# EAGLE design displayBoard (EAGLE 7.4.0)
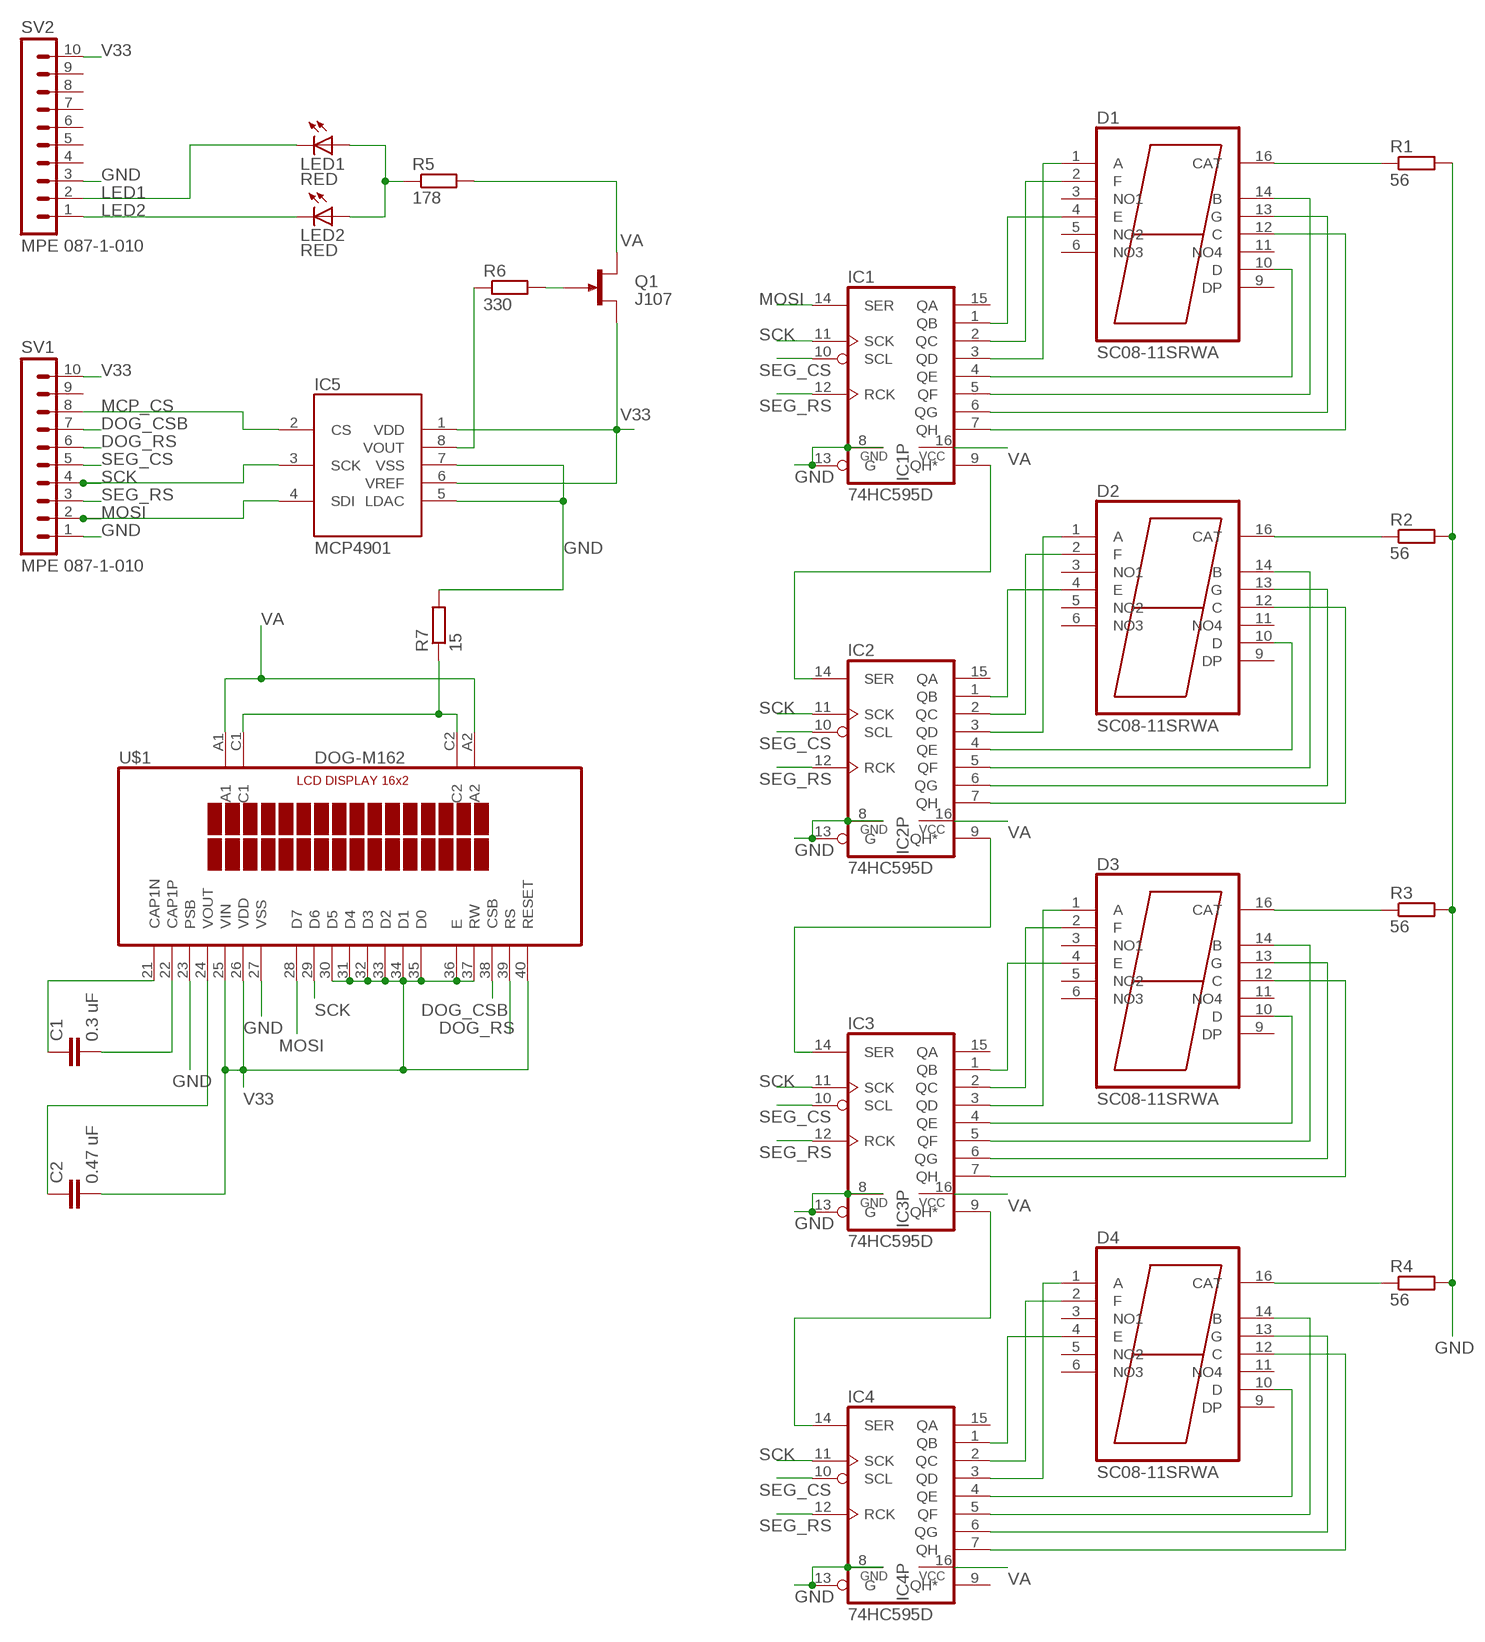
[diagram p0: schematic, sheet 1]

## Parts
C1  0.3 uF  C-EUC1206  [C1206]
C2  0.47 uF  C-EUC1206  [C1206]
D1  SC08-11SRWA  [SC08-11SRWA]
D2  SC08-11SRWA  [SC08-11SRWA]
D3  SC08-11SRWA  [SC08-11SRWA]
D4  SC08-11SRWA  [SC08-11SRWA]
IC1  74HC595D  [SO16]
IC2  74HC595D  [SO16]
IC3  74HC595D  [SO16]
IC4  74HC595D  [SO16]
IC5  MCP4901  [MSOP8]
LED1  RED  LED3MM  [LED3MM]
LED2  RED  LED3MM  [LED3MM]
Q1  J107  J105  [TO92R]
R1  56  R-EU_R1206  [R1206]
R2  56  R-EU_R1206  [R1206]
R3  56  R-EU_R1206  [R1206]
R4  56  R-EU_R1206  [R1206]
R5  178  R-EU_R1206  [R1206]
R6  330  R-EU_R1206  [R1206]
R7  15  R-EU_R1206  [R1206]
SV1  MPE 087-1-010  MA10-1  [MA10-1]
SV2  MPE 087-1-010  MA10-1  [MA10-1]
U$1  DOG-M162  [DOGM162]

## Nets
DOG_CSB: SV1.7 U$1.38(CSB)
DOG_RS: SV1.6 U$1.39(RS)
GND: IC1.8(GND) IC1.13(G) IC2.8(GND) IC2.13(G) IC3.8(GND) IC3.13(G) IC4.8(GND) IC4.13(G) IC5.5(LDAC) IC5.7(VSS) R1.2 R2.2 R3.2 R4.2 R7.2 SV1.1 SV2.3 U$1.23(PSB) U$1.27(VSS)
LED1: LED1.K(C) SV2.2
LED2: LED2.K(C) SV2.1
MCP_CS: IC5.2(CS) SV1.8
MOSI: IC1.14(SER) IC5.4(SDI) SV1.2 U$1.28(D7)
N$1: D1.4(E) IC1.1(QB)
N$2: D1.2(F) IC1.2(QC)
N$3: D1.1(A) IC1.3(QD)
N$4: D1.10(D) IC1.4(QE)
N$5: D1.14(B) IC1.5(QF)
N$6: D1.13(G) IC1.6(QG)
N$7: D1.12(C) IC1.7(QH)
N$8: D2.4(E) IC2.1(QB)
N$9: D2.2(F) IC2.2(QC)
N$10: D2.1(A) IC2.3(QD)
N$11: D2.10(D) IC2.4(QE)
N$12: D2.14(B) IC2.5(QF)
N$13: D2.13(G) IC2.6(QG)
N$14: D2.12(C) IC2.7(QH)
N$17: IC1.9(QH*) IC2.14(SER)
N$22: D3.4(E) IC3.1(QB)
N$23: D3.2(F) IC3.2(QC)
N$24: D3.1(A) IC3.3(QD)
N$25: D3.10(D) IC3.4(QE)
N$26: D3.14(B) IC3.5(QF)
N$27: D3.13(G) IC3.6(QG)
N$28: D3.12(C) IC3.7(QH)
N$29: D4.4(E) IC4.1(QB)
N$30: D4.2(F) IC4.2(QC)
N$31: D4.1(A) IC4.3(QD)
N$32: D4.10(D) IC4.4(QE)
N$33: D4.14(B) IC4.5(QF)
N$34: D4.13(G) IC4.6(QG)
N$35: D4.12(C) IC4.7(QH)
N$36: IC3.9(QH*) IC4.14(SER)
N$37: IC2.9(QH*) IC3.14(SER)
N$38: D1.16(CAT) R1.1
N$39: D2.16(CAT) R2.1
N$40: D3.16(CAT) R3.1
N$41: D4.16(CAT) R4.1
N$42: LED1.A LED2.A R5.1
N$46: C1.1 U$1.21(CAP1N)
N$47: C1.2 U$1.22(CAP1P)
N$48: C2.1 U$1.24(VOUT)
N$52: IC5.8(VOUT) R6.1
N$53: Q1.G R6.2
N$60: R7.1 U$1.C1 U$1.C2
SCK: IC1.11(SCK) IC2.11(SCK) IC3.11(SCK) IC4.11(SCK) IC5.3(SCK) SV1.4 U$1.29(D6)
SEG_CS: IC1.10(SCL) IC2.10(SCL) IC3.10(SCL) IC4.10(SCL) SV1.5
SEG_RS: IC1.12(RCK) IC2.12(RCK) IC3.12(RCK) IC4.12(RCK) SV1.3
V33: C2.2 IC5.1(VDD) IC5.6(VREF) Q1.S SV1.10 SV2.10 U$1.25(VIN) U$1.26(VDD) U$1.30(D5) U$1.31(D4) U$1.32(D3) U$1.33(D2) U$1.34(D1) U$1.35(D0) U$1.36(E) U$1.37(RW) U$1.40(RESET)
VA: IC1.16(VCC) IC2.16(VCC) IC3.16(VCC) IC4.16(VCC) Q1.D R5.2 U$1.A1 U$1.A2
Unconnected: D1.3(NO1) D1.5(NO2) D1.6(NO3) D1.9(DP) D1.11(NO4) D2.3(NO1) D2.5(NO2) D2.6(NO3) D2.9(DP) D2.11(NO4) D3.3(NO1) D3.5(NO2) D3.6(NO3) D3.9(DP) D3.11(NO4) D4.3(NO1) D4.5(NO2) D4.6(NO3) D4.9(DP) D4.11(NO4) IC1.15(QA) IC2.15(QA) IC3.15(QA) IC4.9(QH*) IC4.15(QA) SV1.9 SV2.4 SV2.5 SV2.6 SV2.7 SV2.8 SV2.9

## Library data of the parts
C1 C2 = resistor:C-EU: CAPACITOR, European symbol
D1-D4 = MyComponents:SC08-11SRWA: 20.32mm (0.8INCH) SINGLE DIGIT NUMERIC DISPLAY
IC1-IC4 = 74xx-eu:74*595: 8-bit SHIFT REGISTER, output latch
IC5 = MyComponents:MCP4901: 8/10/12-Bit Voltage Output Digital-to-Analog Converter with SPI Interface
LED1 LED2 = led:LED: LED OSRAM: - CHIPLED LG R971, LG N971, LY N971, LG Q971, LY Q971, LO R971, LY R971 LH N974, LH R974 LS Q976, LO Q976, LY Q976 LO Q996 - Hyper CHIPLED LW Q18S LB Q993, LB Q99A, LB R99A - SideLED LS A670, LO A670, LY A670, LG A670, LP A670 LB A673, LV A673, LT A673, LW A673 LH A674 LY A675 LS A676, LA A676, LO A676, LY A676, LW A676 LS A679, LY A679, LG A679 - Hyper Micro SIDELED® LS Y876, LA Y876, LO Y876, LY Y876 LT Y87S - SmartLED LW L88C, LW L88S LB L89C, LB L89S, LG L890 LS L89K, LO L89K, LY L89K LS L896, LA L896, LO L896, LY L896 - TOPLED LS T670, LO T670, LY T670, LG T670, LP T670 LSG T670, LSP T670, LSY T670, LOP T670, LYG T670 LG T671, LOG T671, LSG T671 LB T673, LV T673, LT T673, LW T673 LH T674 LS T676, LA T676, LO T676, LY T676, LB T676, LH T676, LSB T676, LW T676 LB T67C, LV T67C, LT T67C, LS T67K, LO T67K, LY T67K, LW E67C LS E67B, LA E67B, LO E67B, LY E67B, LB E67C, LV E67C, LT E67C LW T67C LS T679, LY T679, LG T679 LS T770, LO T770, LY T770, LG T770, LP T770 LB T773, LV T773, LT T773, LW T773 LH T774 LS E675, LA E675, LY E675, LS T675 LS T776, LA T776, LO T776, LY T776, LB T776 LHGB T686 LT T68C, LB T68C - Hyper Mini TOPLED® LB M676 - Mini TOPLED Santana® LG M470 LS M47K, LO M47K, LY M47K Source: http://www.osram.convergy.de LUXEON: - LUMILED® LXK2-PW12-R00, LXK2-PW12-S00, LXK2-PW14-U00, LXK2-PW14-V00 LXK2-PM12-R00, LXK2-PM12-S00, LXK2-PM14-U00 LXK2-PE12-Q00, LXK2-PE12-R00, LXK2-PE12-S00, LXK2-PE14-T00, LXK2-PE14-U00 LXK2-PB12-K00, LXK2-PB12-L00, LXK2-PB12-M00, LXK2-PB14-N00, LXK2-PB14-P00, LXK2-PB14-Q00 LXK2-PR12-L00, LXK2-PR12-M00, LXK2-PR14-Q00, LXK2-PR14-R00 LXK2-PD12-Q00, LXK2-PD12-R00, LXK2-PD12-S00 LXK2-PH12-R00, LXK2-PH12-S00 LXK2-PL12-P00, LXK2-PL12-Q00, LXK2-PL12-R00 Source: www.luxeon.com KINGBRIGHT: KA-3528ASYC Source: www.kingbright.com
Q1 = transistor-small-signal:J105: N-CHANNEL FET J105, J106, J107 Source: http://www.fairchildsemi.com/pf/J1/J105.html
R1-R7 = resistor:R-EU_: RESISTOR, European symbol
SV1 SV2 = con-lstb:MA10-1: PIN HEADER; OC_FARNELL: unknown; OC_NEWARK: unknown
U$1 = MyComponents:DOG-M162: LCD display DOG-SERIE 3,3V. Controlleer ST7036 for 4-/8-BIT, SPI.

## Board
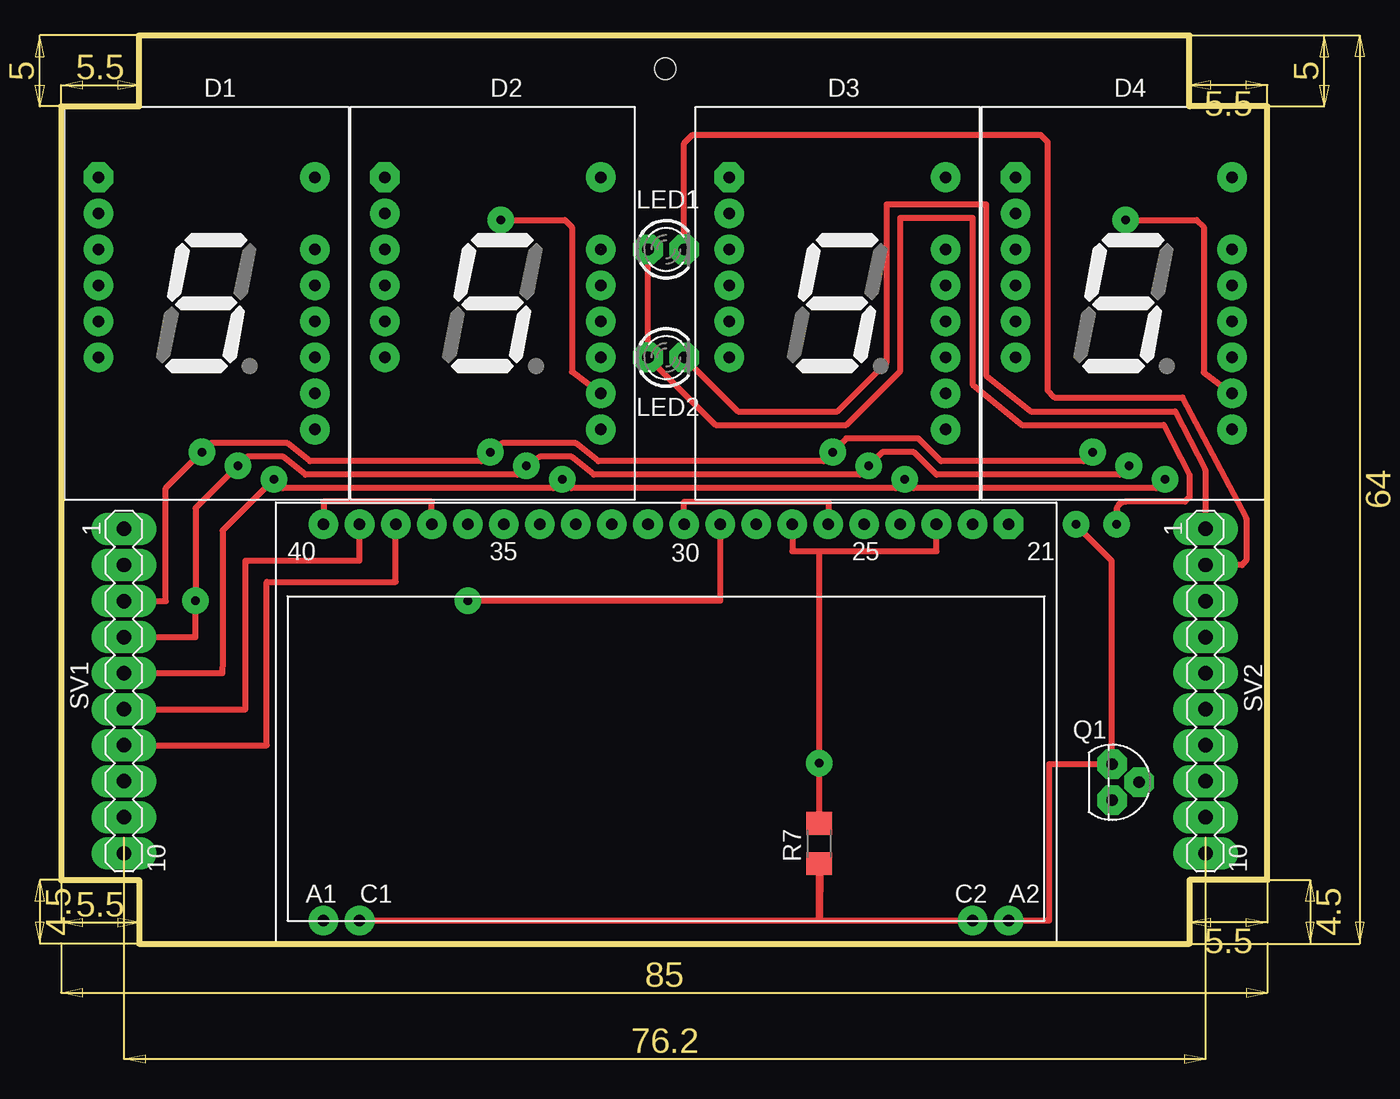
[diagram p1: board, top side]
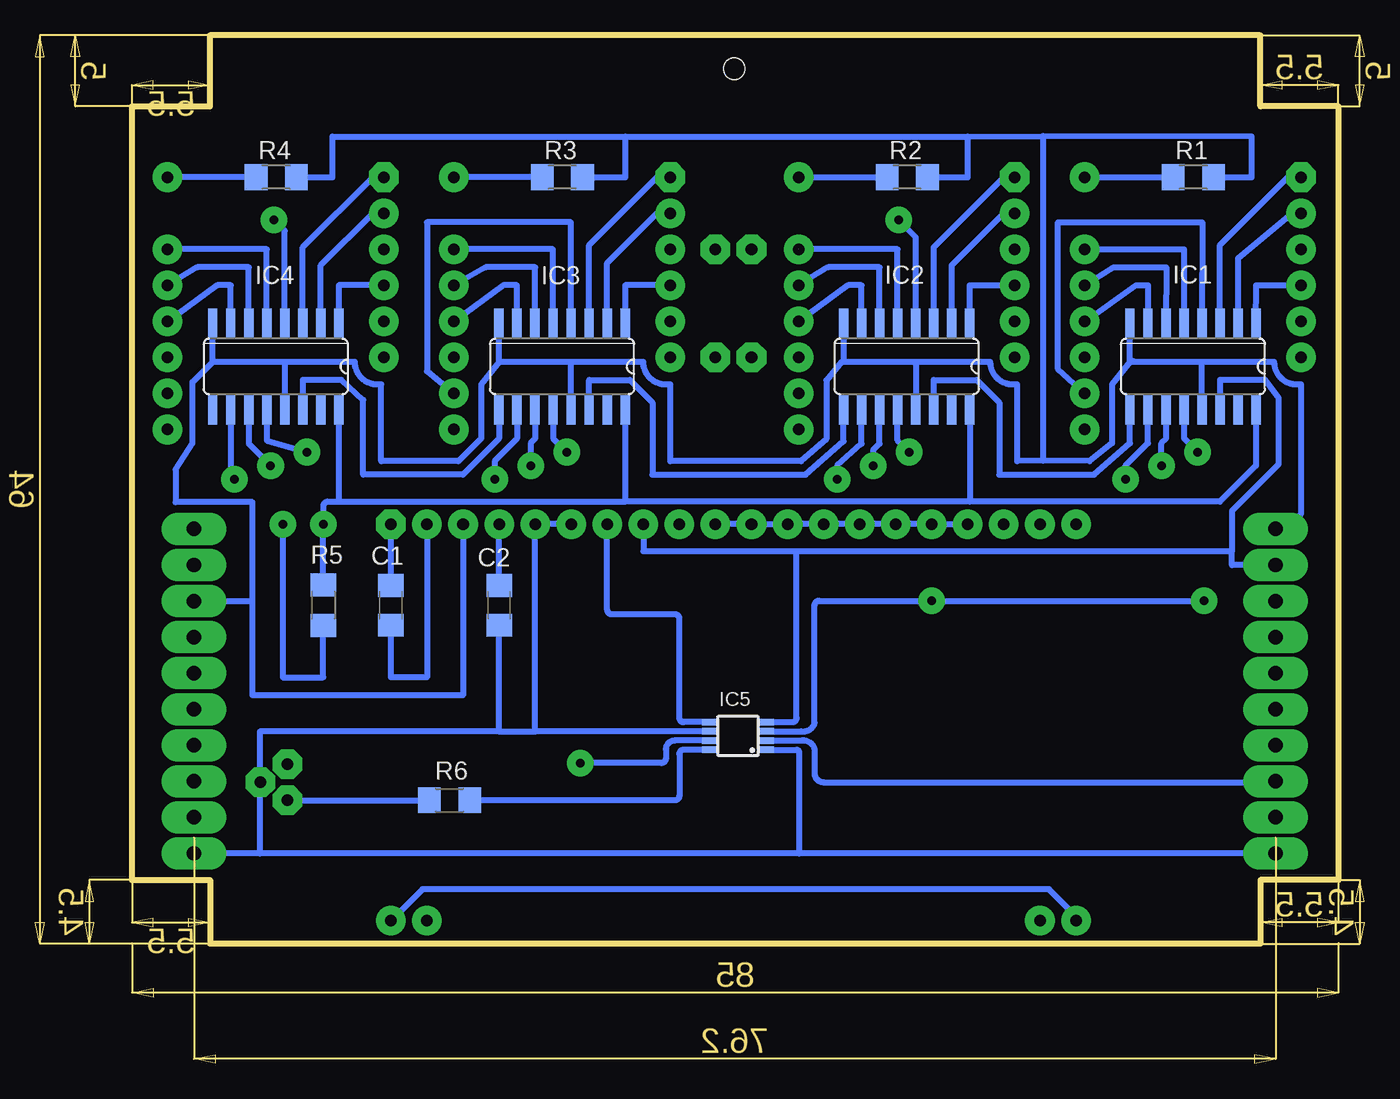
[diagram p2: board, bottom side, seen from below]

Size 85 x 64 mm. Coordinates in mm from the lower left corner, seen from the top.
Outline: 5.5,64 79.5,64 79.5,59 85,59 85,4.5 79.5,4.5 79.5,0 5.5,0 5.5,4.5 0,4.5 0,59 5.5,59 5.5,64
Copper layers (1*16): Top 0.035mm / dielectric 1.5mm / Bottom 0.035mm
Design rules "default": minimum track width 20mil, minimum drill 32mil, track to track 12mil, track to pad 12mil, pad to pad 12mil, via to via 12mil, smd to smd 8mil, copper to edge 40mil, drill to drill 40mil, minimum pad ring 25mil, minimum via ring 25mil, stop-mask expansion 4mil, vias tented up to drill 0mil, thermal gap 10mil
Holes 1.5 mm at 42.56,61.66

### Footprints (pad centres in the part's own frame; a part is rotated, then mirrored left to right if it is on the bottom)
C1206 = smd 1.6 x 1.8: 1 -1.4,0; 2 1.4,0
SC08-11SRWA = drill 0.813 octagon: 1 -7.62,8.89 | drill 0.813: 2 -7.62,6.35; 3 -7.62,3.81; 4 -7.62,1.27; 5 -7.62,-1.27; 6 -7.62,-3.81; 9 7.62,-8.89; 10 7.62,-6.35; 11 7.62,-3.81; 12 7.62,-1.27; 13 7.62,1.27; 14 7.62,3.81; 16 7.62,8.89
SO16 = smd 0.66 x 2.032: 1 -4.445,-3.073; 2 -3.175,-3.073; 3 -1.905,-3.073; 4 -0.635,-3.073; 5 0.635,-3.073; 6 1.905,-3.073; 7 3.175,-3.073; 8 4.445,-3.073; 9 4.445,3.073; 10 3.175,3.073; 11 1.905,3.073; 12 0.635,3.073; 13 -0.635,3.073; 14 -1.905,3.073; 15 -3.175,3.073; 16 -4.445,3.073
MSOP8 = smd 0.45 x 1: 1 -0.975,-2.05; 2 -0.325,-2.05; 3 0.325,-2.05; 4 0.975,-2.05; 5 0.975,2.05; 6 0.325,2.05; 7 -0.325,2.05; 8 -0.975,2.05
LED3MM = drill 0.813 octagon: A -1.27,0; K 1.27,0
TO92R = drill 0.813 octagon: D -1.27,0; G 1.27,0; S 0,1.905
R1206 = smd 1.6 x 1.803: 1 -1.422,0; 2 1.422,0
MA10-1 = drill 1.016 long: 1 -11.43,0; 2 -8.89,0; 3 -6.35,0; 4 -3.81,0; 5 -1.27,0; 6 1.27,0; 7 3.81,0; 8 6.35,0; 9 8.89,0; 10 11.43,0
DOGM162 = drill 0.813 octagon: 21 24.13,13.97 | drill 0.813: 22 21.59,13.97; 23 19.05,13.97; 24 16.51,13.97; 25 13.97,13.97; 26 11.43,13.97; 27 8.89,13.97; 28 6.35,13.97; 29 3.81,13.97; 30 1.27,13.97; 31 -1.27,13.97; 32 -3.81,13.97; 33 -6.35,13.97; 34 -8.89,13.97; 35 -11.43,13.97; 36 -13.97,13.97; 37 -16.51,13.97; 38 -19.05,13.97; 39 -21.59,13.97; 40 -24.13,13.97; A1 -24.13,-13.97; A2 24.13,-13.97; C1 -21.59,-13.97; C2 21.59,-13.97

### Placement (x,y rotation side)
C1  66.75,23.85 270 bottom
C2  59.14,23.85 270 bottom
D1  10.25,45.12 0 top
D2  30.42,45.12 0 top
D3  54.7,45.12 0 top
D4  74.87,45.12 0 top
IC1  10.25,40.68 180 bottom
IC2  30.42,40.68 180 bottom
IC3  54.7,40.68 180 bottom
IC4  74.87,40.68 180 bottom
IC5  42.31,14.64 90 bottom
LED1  42.62,48.94 0 top
LED2  42.62,41.31 0 top
Q1  74.06,11.38 270 top
R1  10.23,54.02 0 bottom
R2  30.38,54.02 0 bottom
R3  54.68,54.02 0 bottom
R4  74.83,54.02 0 bottom
R5  71.52,23.85 90 bottom
R6  62.63,10.11 180 bottom
R7  53.4,7.06 90 top
SV1  4.43,17.8 270 top
SV2  80.63,17.8 270 top
U$1  42.62,15.6 0 top

### Tracks (layer width: path | path; a pad name or v marks a point on that pad's centre or on a via)
DOG_CSB
  Top 0.406: SV1.7 14.5,13.99 14.5,25.5 23.57,25.5 U$1.38
DOG_RS
  Top 0.406: SV1.6 13,16.53 13,27 21.04,27 U$1.39
GND  (via drill 0.6)
  Top 0.406: U$1.27 51.52,27.66 53.42,27.66 | 53.42,27.66 61.67,27.66 U$1.23 | 53.42,27.66 v53.42,12.74 53.41,12.74 R7.2
  Bottom 0.406: 14.37,41 14.68,41 | 14.68,41 14.68,43.74 IC1.8 | IC2.8 34.87,41 | 14.68,41 15.95,39.41 15.95,35.28 17.54,34.01 20.81,34.04 | 20.81,34.04 22.62,34.01 22.62,39.41 22.94,39.41 arc90 24.53,41 29.61,41 | 29.61,41 34.87,41 | 29.92,37.61 IC2.13 29.78,40.82 arc90 29.61,41 | 34.87,41 35.01,41 36.08,39.69 36.08,35.56 37.86,34.01 47.07,34.01 47.07,39.41 47.39,39.41 arc90 48.98,41 54.05,41 | 54.05,41 59.14,41 | 59.14,41 59.14,43.74 arc-90 IC3.8 | 54.05,41 arc-90 54.07,40.98 IC3.13 54.07,37.29 | SV1.1 2.62,30.3 2.62,39.41 2.94,39.41 arc90 4.53,41 9.61,41 | 9.61,41 14.37,41 | 14.37,41 arc-90 14.68,41 | IC1.13 9.62,40.98 arc90 9.61,41 | 59.14,41 60.41,39.41 60.41,35.6 61.99,34.01 67.44,34.01 67.44,39.41 67.71,39.41 arc90 69.3,41 74.23,41 | 74.23,41 79.31,41 | 79.31,41 IC4.8 | 74.23,41 IC4.13 | R4.2 70.88,54.02 70.88,56.87 50.24,56.87 | 50.24,56.87 26.11,56.87 | 26.11,56.87 20.81,56.9 | R1.2 6.11,54.02 6.11,56.87 20.81,56.9 | R2.2 26.11,54.02 26.11,56.87 | R3.2 50.24,54.02 50.24,56.87 | 79.31,41 80.72,39.59 80.72,35.28 81.92,33.42 81.92,31.12 76.5,31.12 76.5,24.15 | IC5.5 46.14,15.62 arc90 46.44,15.91 46.44,22.9 arc-90 46.75,23.22 51.2,23.22 arc90 51.52,23.54 U$1.27 | IC5.7 46.76,14.32 arc-90 47.39,13.69 47.39,13.06 arc90 47.7,12.74 v53.42,12.74 | U$1.23 61.67,17.5 76.5,17.5 76.5,24.15 | 20.81,56.9 20.81,34.04 | SV2.3 76.5,24.15
LED1
  Top 0.406: LED1.K 43.9,56.4 44.5,57 69,57 69.5,56.5 69.5,39 70,38.5 79,38.5 83.5,30 83.5,27 83.19,26.69 SV2.2
LED2
  Top 0.406: LED2.K 47.7,37.51 54.69,37.51 58.18,41 58.18,52.11 65.17,52.11 65.17,40.05 68.34,37.51 78.5,37.51 80.61,33.41 80.61,28.76 SV2.1
MCP_CS
  Bottom 0.406: IC5.2 37.85,14.32 arc90 36.91,13.69 36.91,12.02 arc-90 36.27,11.38 4.57,11.38 arc-90 SV1.8
MOSI
  Bottom 0.406: IC1.14 8.35,39.73 5.16,39.73 4.21,38.46 4.21,33.79 7.5,30.5 7.5,27.66 | U$1.28 48.98,27.66 38.18,27.66 | IC5.4 38.48,15.62 arc-90 38.18,15.91 38.18,27.66 | 38.18,27.66 7.5,27.66 | SV1.2 7.5,26.69 7.5,27.66
N$1
  Bottom 0.406: IC1.1 5.79,46.4 D1.4
N$2
  Bottom 0.406: IC1.2 7.06,43.77 7.06,48.3 3.26,51.48 D1.2
N$3
  Bottom 0.406: IC1.3 8.35,49.24 3.57,54.02 D1.1
N$4
  Bottom 0.406: D1.10 19.77,40.49 19.77,50.84 9.61,50.84 IC1.4
N$5
  Bottom 0.406: D1.14 10.89,48.94 IC1.5
N$6
  Bottom 0.406: D1.13 15.85,47.66 12.14,47.66 IC1.6
N$7
  Bottom 0.406: D1.12 14.27,46.4 13.41,46.4 IC1.7
N$8
  Bottom 0.406: IC2.1 25.98,46.4 D2.4
N$9
  Bottom 0.406: IC2.2 27.24,47.8 23.57,51.48 D2.2
N$10
  Bottom 0.406: IC2.3 28.52,49.08 23.57,54.02 D2.1
N$11  (via drill 0.6)
  Top 0.406: v31,51 35.5,51 36,50.5 36,40.31 D2.10
  Bottom 0.406: IC2.4 29.78,49.78 v31,51
N$12  (1 unrouted)
  Bottom 0.406: IC2.5 31.05,48.94 D2.14
N$13
  Bottom 0.406: IC2.6 32.33,47.66 35.96,47.66 D2.13
N$14
  Bottom 0.406: IC2.7 33.59,46.4 34.55,46.4 D2.12
N$15  (via drill 0.6)
  other vias: 12.46,33.7
N$16  (via drill 0.6)
  other vias: 32.78,33.7 56.91,33.7 75.23,33.7
N$17
  Bottom 0.406: IC2.14 28.52,39.73 25.48,39.73 23.89,38.14 23.89,33.06 17.23,33.06 14.68,35.28 IC1.9
N$18  (via drill 0.6)
  other vias: 15,32.74
N$19  (via drill 0.6)
  other vias: 35.32,32.74 59.45,32.74 77.77,32.74
N$20  (via drill 0.6)
  other vias: 30.24,34.65 54.37,34.65 72.69,34.65
N$21  (via drill 0.6)
  other vias: 9.92,34.65
N$22
  Bottom 0.406: D3.4 50.24,46.4 arc-90 50.26,46.38 IC3.1
N$23
  Bottom 0.406: IC3.2 51.53,47.97 48.02,51.48 D3.2
N$24
  Bottom 0.406: IC3.3 52.8,49.24 48.02,54.02 D3.1
N$25
  Bottom 0.406: IC3.4 54.07,50.84 64.22,50.84 64.22,40.35 D3.10
N$26
  Bottom 0.406: IC3.5 55.34,48.94 D3.14
N$27
  Bottom 0.406: IC3.6 56.59,47.66 60.09,47.66 D3.13
N$28
  Bottom 0.406: IC3.7 57.88,46.4 58.83,46.4 D3.12
N$29
  Bottom 0.406: D4.4 70.42,46.4 IC4.1
N$30
  Bottom 0.406: IC4.2 71.69,47.8 68.03,51.48 D4.2
N$31
  Bottom 0.406: IC4.3 72.97,49.08 68.03,54.02 D4.1
N$32  (via drill 0.6)
  Top 0.406: v75,51 80,51 80.5,50.5 80.5,40.27 D4.10
  Bottom 0.406: IC4.4 74.23,50.23 v75,51
N$33
  Bottom 0.406: IC4.5 75.5,48.94 D4.14
N$34
  Bottom 0.406: IC4.6 76.78,47.66 80.41,47.66 D4.13
N$35
  Bottom 0.406: IC4.7 78.05,46.4 79,46.4 D4.12
N$36
  Bottom 0.406: IC3.9 59.15,35.59 61.67,33.06 68.71,33.06 68.71,38.32 70.25,39.73 72.97,39.73 IC4.14
N$37
  Bottom 0.406: IC3.14 52.8,39.73 49.93,39.73 48.34,38.14 48.34,33.06 37.55,33.06 34.87,35.42 IC2.9
N$38
  Bottom 0.406: D1.16 R1.1
N$39
  Bottom 0.406: D2.16 R2.1
N$40
  Bottom 0.406: R3.1 D3.16
N$41
  Bottom 0.406: R4.1 D4.16
N$42  (via drill 0.6)
  Top 0.406: LED1.A LED2.A 46.12,36.55 55.33,36.55 59.14,40.36 59.14,51.16 64.22,51.16 64.22,39.41 67.71,36.55 77.69,36.55 79.5,33.06 79.5,31.47 79.18,31.16 75.01,31.16 arc90 74.38,30.52 v74.38,29.57
  Bottom 0.406: v74.38,29.57 74.38,18.77 71.52,18.77 R5.1
N$45  (via drill 0.6)
  other vias: 74.38,29.57
N$46
  Bottom 0.406: C1.1 U$1.21
N$47
  Bottom 0.406: U$1.22 64.22,18.77 66.75,18.77 C1.2
N$48
  Bottom 0.406: C2.1 U$1.24
N$50  (via drill 0.6)
  other vias: 28.66,24.17
N$51  (via drill 0.6)
  other vias: 9.47,24.17
N$52
  Bottom 0.406: IC5.8 46.14,13.67 arc-90 46.44,13.38 46.44,10.43 arc90 46.75,10.11 R6.1
N$53
  Bottom 0.406: Q1.G R6.2
N$55  (via drill 0.6)
  other vias: 71.52,29.57
N$56  (via drill 0.6)
  other vias: 53.42,12.74
N$57  (via drill 0.6)
  other vias: 75,51
N$58  (via drill 0.6)
  other vias: 31,51
N$60
  Top 0.406: U$1.C2 53.41,1.63 R7.1 53.5,5.64 53.47,1.63 21,1.63 U$1.C1
SCK  (via drill 0.6)
  Top 0.406: v75.23,33.7 74.6,33.06 61.67,33.06 60.09,34.65 57.87,34.65 v56.91,33.7 56.28,33.06 37.55,33.06 35.96,34.33 33.73,34.33 v32.78,33.7 32.15,33.06 17.23,33.06 15.64,34.33 13.1,34.33 v12.46,33.7 9.47,30.7 v9.47,24.17 9.47,21.61 SV1.4 | U$1.29 46.44,24.17 v28.66,24.17
  Bottom 0.406: v32.78,33.7 32.78,34.78 32.33,35.24 IC2.11 | v12.46,33.7 12.46,35.28 12.14,35.6 IC1.11 | IC3.11 56.59,37.59 56.59,35.6 56.91,35.28 v56.91,33.7 | v9.47,24.17 v28.66,24.17 36.59,24.17 arc-90 36.91,23.85 36.91,15.6 arc90 37.85,14.97 IC5.3 | IC4.11 76.78,35.24 v75.23,33.7
SEG_CS  (via drill 0.6)
  Top 0.406: v77.77,32.74 77.14,32.11 60.09,32.11 v59.45,32.74 58.82,32.11 35.96,32.11 v35.32,32.74 34.69,32.11 15.64,32.11 v15,32.74 11.38,29.11 11.38,19.5 11.38,19.07 SV1.5
  Bottom 0.406: v35.32,32.74 35.32,33.7 33.59,35.24 IC2.10 | v15,32.74 15,33.7 13.41,35.28 IC1.10 | IC3.10 57.88,35.59 59.45,34.01 v59.45,32.74 | IC4.10 78.05,33.02 v77.77,32.74
SEG_RS  (via drill 0.6)
  Top 0.406: v72.69,34.65 72.06,34.01 61.99,34.01 60.41,35.6 55.33,35.6 v54.37,34.65 53.74,34.01 37.86,34.01 36.27,35.28 31.05,35.28 v30.24,34.65 29.61,34.01 17.54,34.01 15.95,35.28 10.56,35.28 v9.92,34.65 7.38,32.11 7.38,24.15 SV1.3
  Bottom 0.406: v9.92,34.65 10.88,35.6 IC1.12 | v30.24,34.65 31.05,35.46 IC2.12 | IC3.12 55.33,37.59 55.33,35.6 v54.37,34.65 | IC4.12 75.5,35.46 v72.69,34.65
V33
  Top 0.406: U$1.30 43.9,31.16 54.05,31.16 U$1.26 | U$1.37 26.11,31.16 18.5,31.16 U$1.40
  Bottom 0.406: U$1.30 U$1.31 U$1.32 U$1.33 U$1.34 U$1.35 U$1.36 U$1.37 | U$1.26 U$1.25 56.59,14.96 | 59.14,14.96 C2.2 | 59.14,14.96 56.59,14.96 | IC5.6 56.59,14.96 | SV1.10 38,6.37 | 38,6.37 76,6.37 | 76,6.37 SV2.10 | 59.14,14.96 76,14.96 76,11.38 | 76,11.38 76,6.37 | Q1.S 76,11.38 | IC5.1 38.17,13.67 arc90 38,13.5 38,6.37
VA  (via drill 0.6)
  Top 0.406: U$1.A2 69.61,1.63 69.61,12.65 Q1.D 74,12.71 74,27 71.52,29.48 v71.52,29.57
  Bottom 0.406: 70.42,31.16 50.24,31.16 | 50.24,31.16 50.24,37.61 IC3.16 | IC2.16 25.98,31.16 | 25.98,31.16 50.24,31.16 | 25.98,31.16 8.35,31.16 5.81,33.7 IC1.16 | R5.2 v71.52,29.57 71.52,30.84 arc90 71.2,31.16 70.5,31.16 70.42,31.16 | U$1.A1 18.5,1.95 20.4,3.85 64.53,3.85 U$1.A2 | IC4.16 70.42,31.16